# Altium schematic sheet MultiChannel.SchDoc
size A4; SheetNumber: 1; SheetTotal: 2
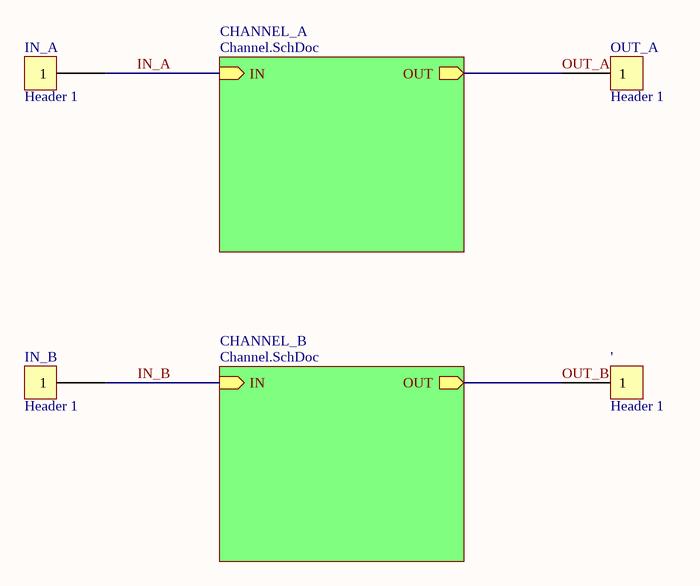
[diagram p0: MultiChannel.SchDoc]

## Parts
'  Header 1  [Header1]
IN_A  Header 1  [Header1]
IN_B  Header 1  [Header1]
OUT_A  Header 1  [Header1]

## Sub-sheets
CHANNEL_A = Channel.SchDoc: OUT (out), IN (in)
CHANNEL_B = Channel.SchDoc: OUT (out), IN (in)

## Nets
IN_A: IN_A.1 ; sheet CHANNEL_A/IN
IN_B: IN_B.1 ; sheet CHANNEL_B/IN
OUT_A: OUT_A.1 ; sheet CHANNEL_A/OUT
OUT_B: '.1 ; sheet CHANNEL_B/OUT